# Altium schematic sheet Alaska 1-2.SchDoc
size A0; SheetNumber: 1; SheetTotal: 1
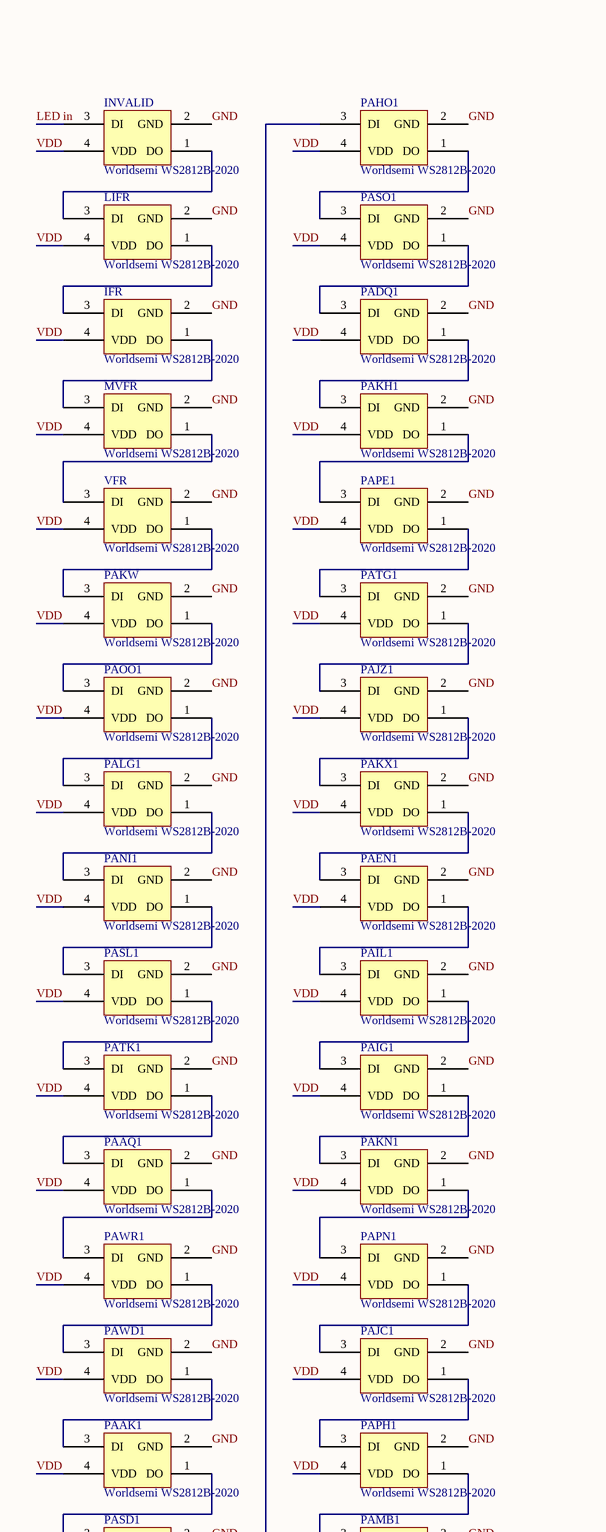
[diagram p0: Alaska 1-2.SchDoc, top left]
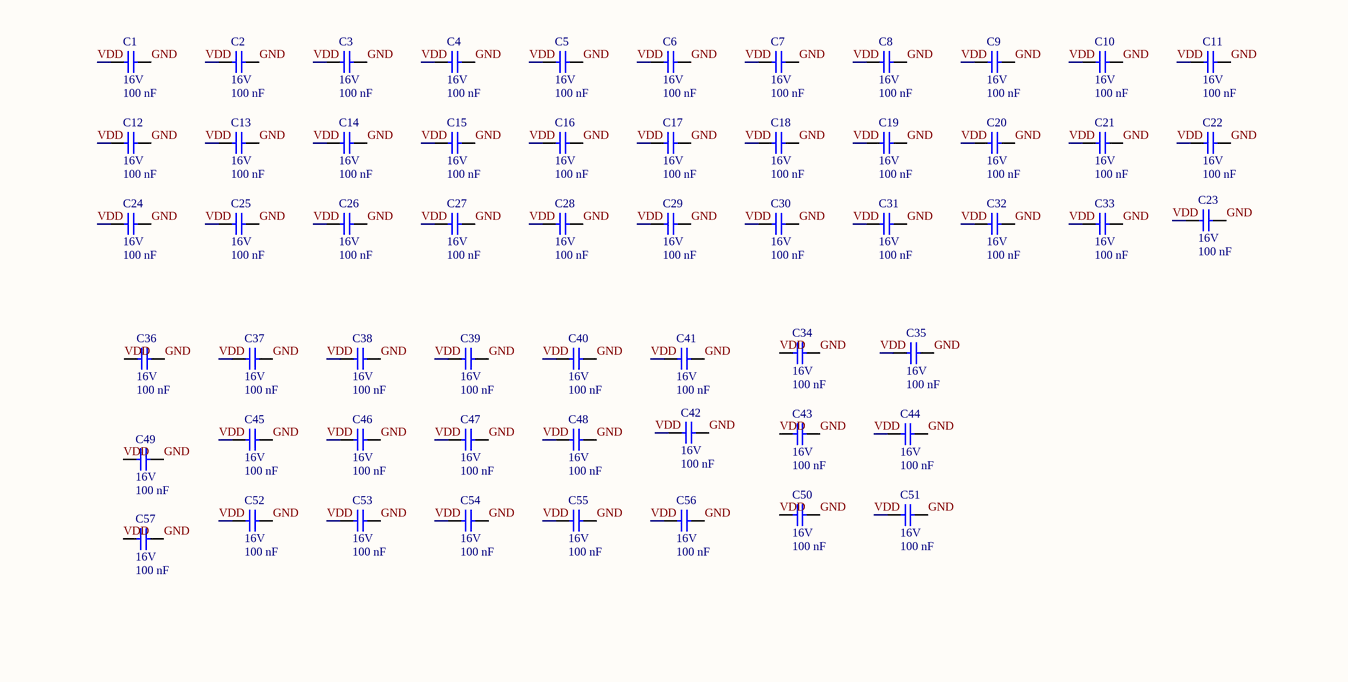
[diagram p1: Alaska 1-2.SchDoc, top middle]
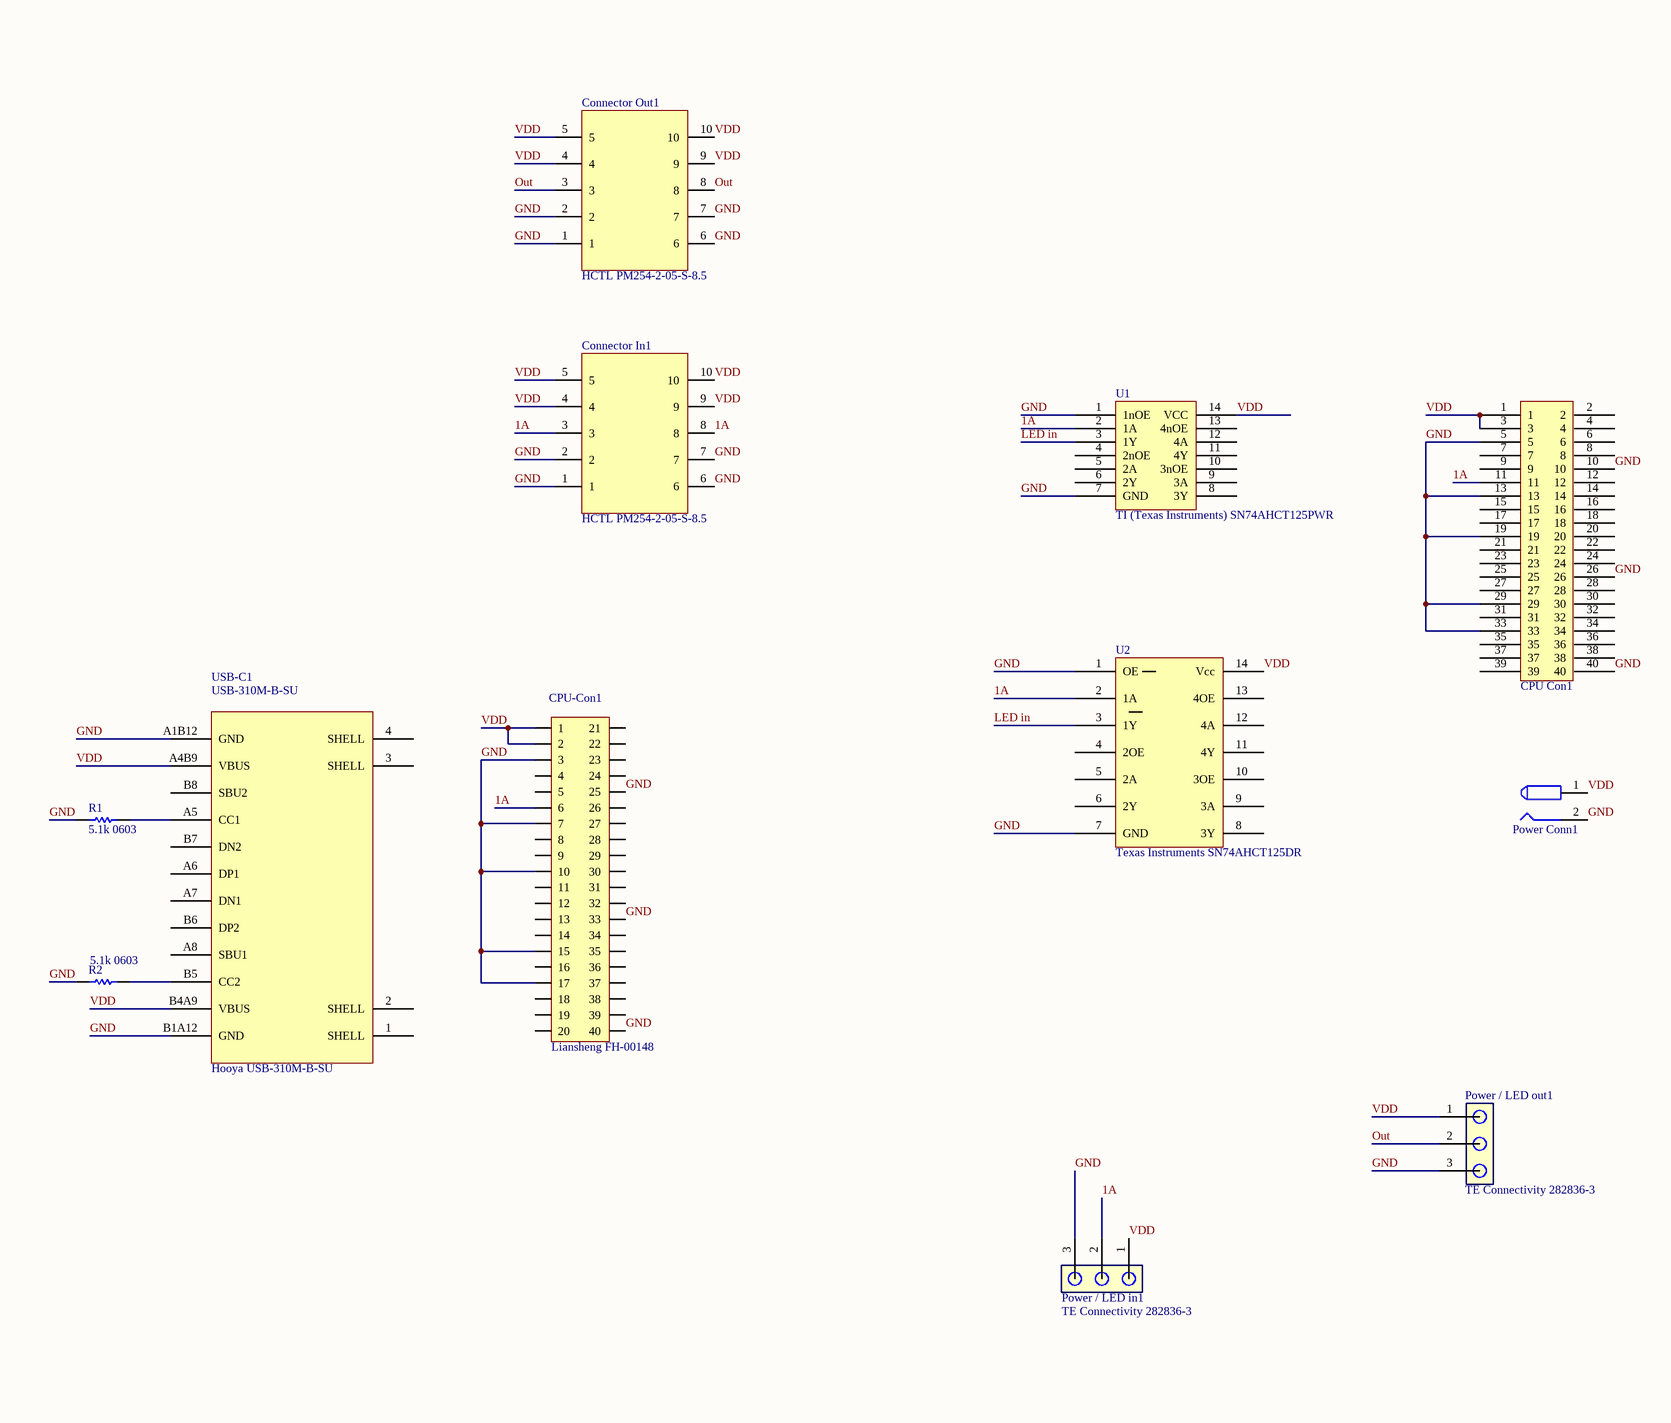
[diagram p2: Alaska 1-2.SchDoc, top right]
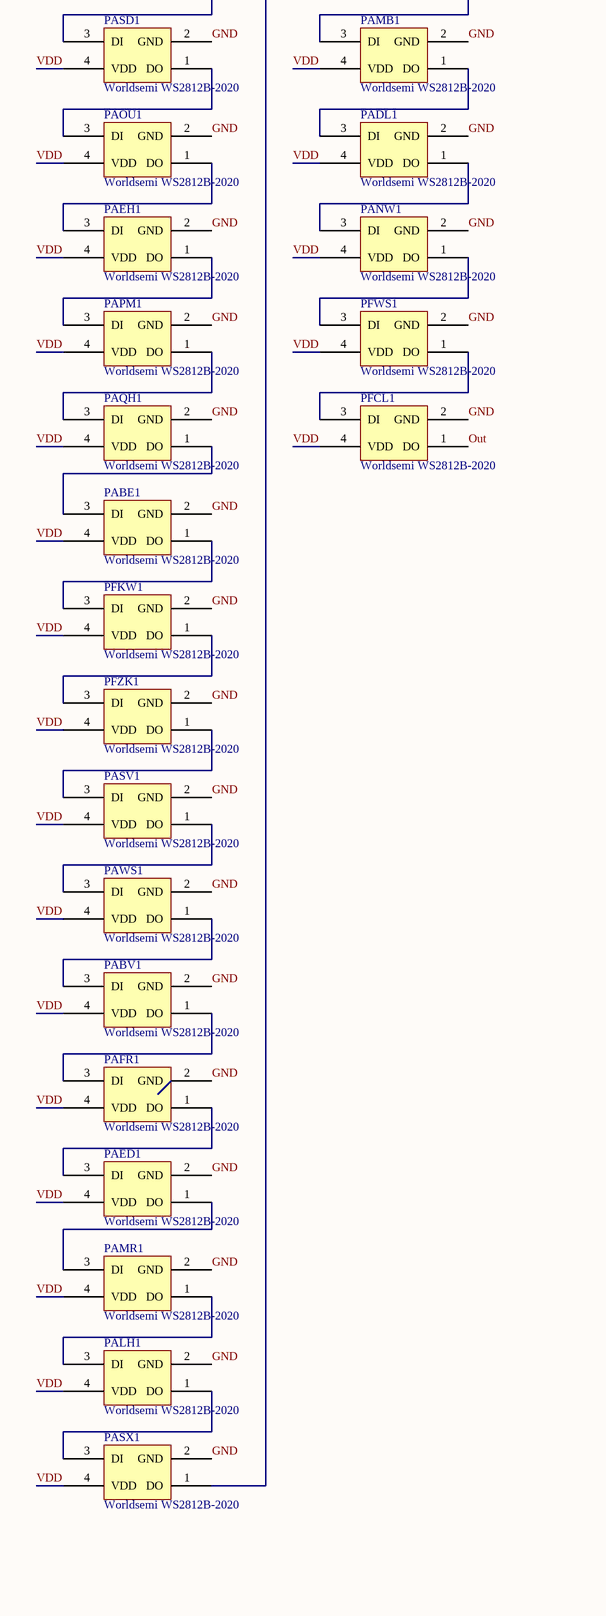
[diagram p3: Alaska 1-2.SchDoc, bottom left]
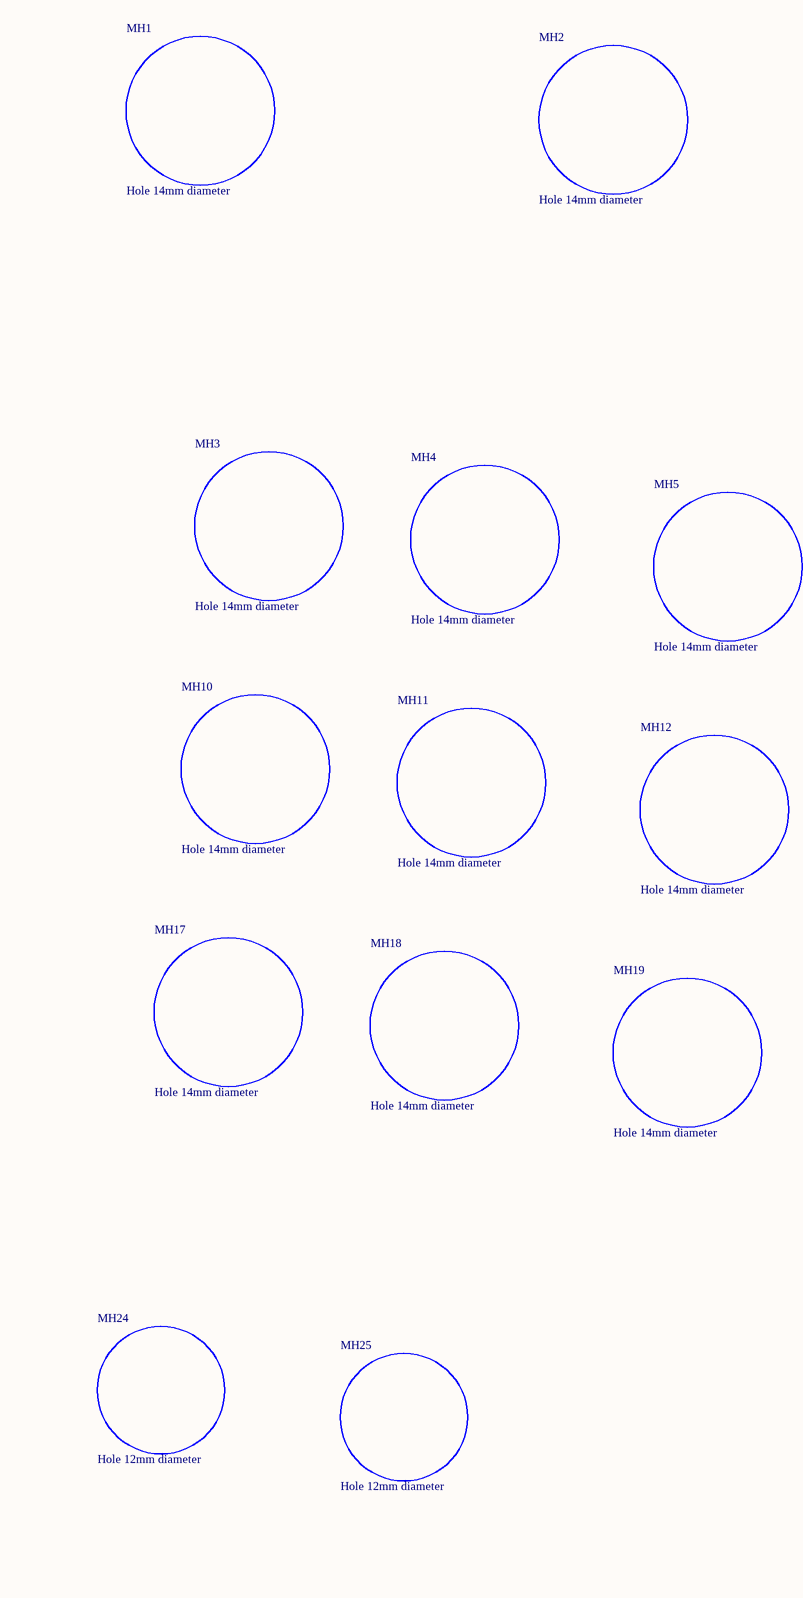
[diagram p4: Alaska 1-2.SchDoc, bottom middle]
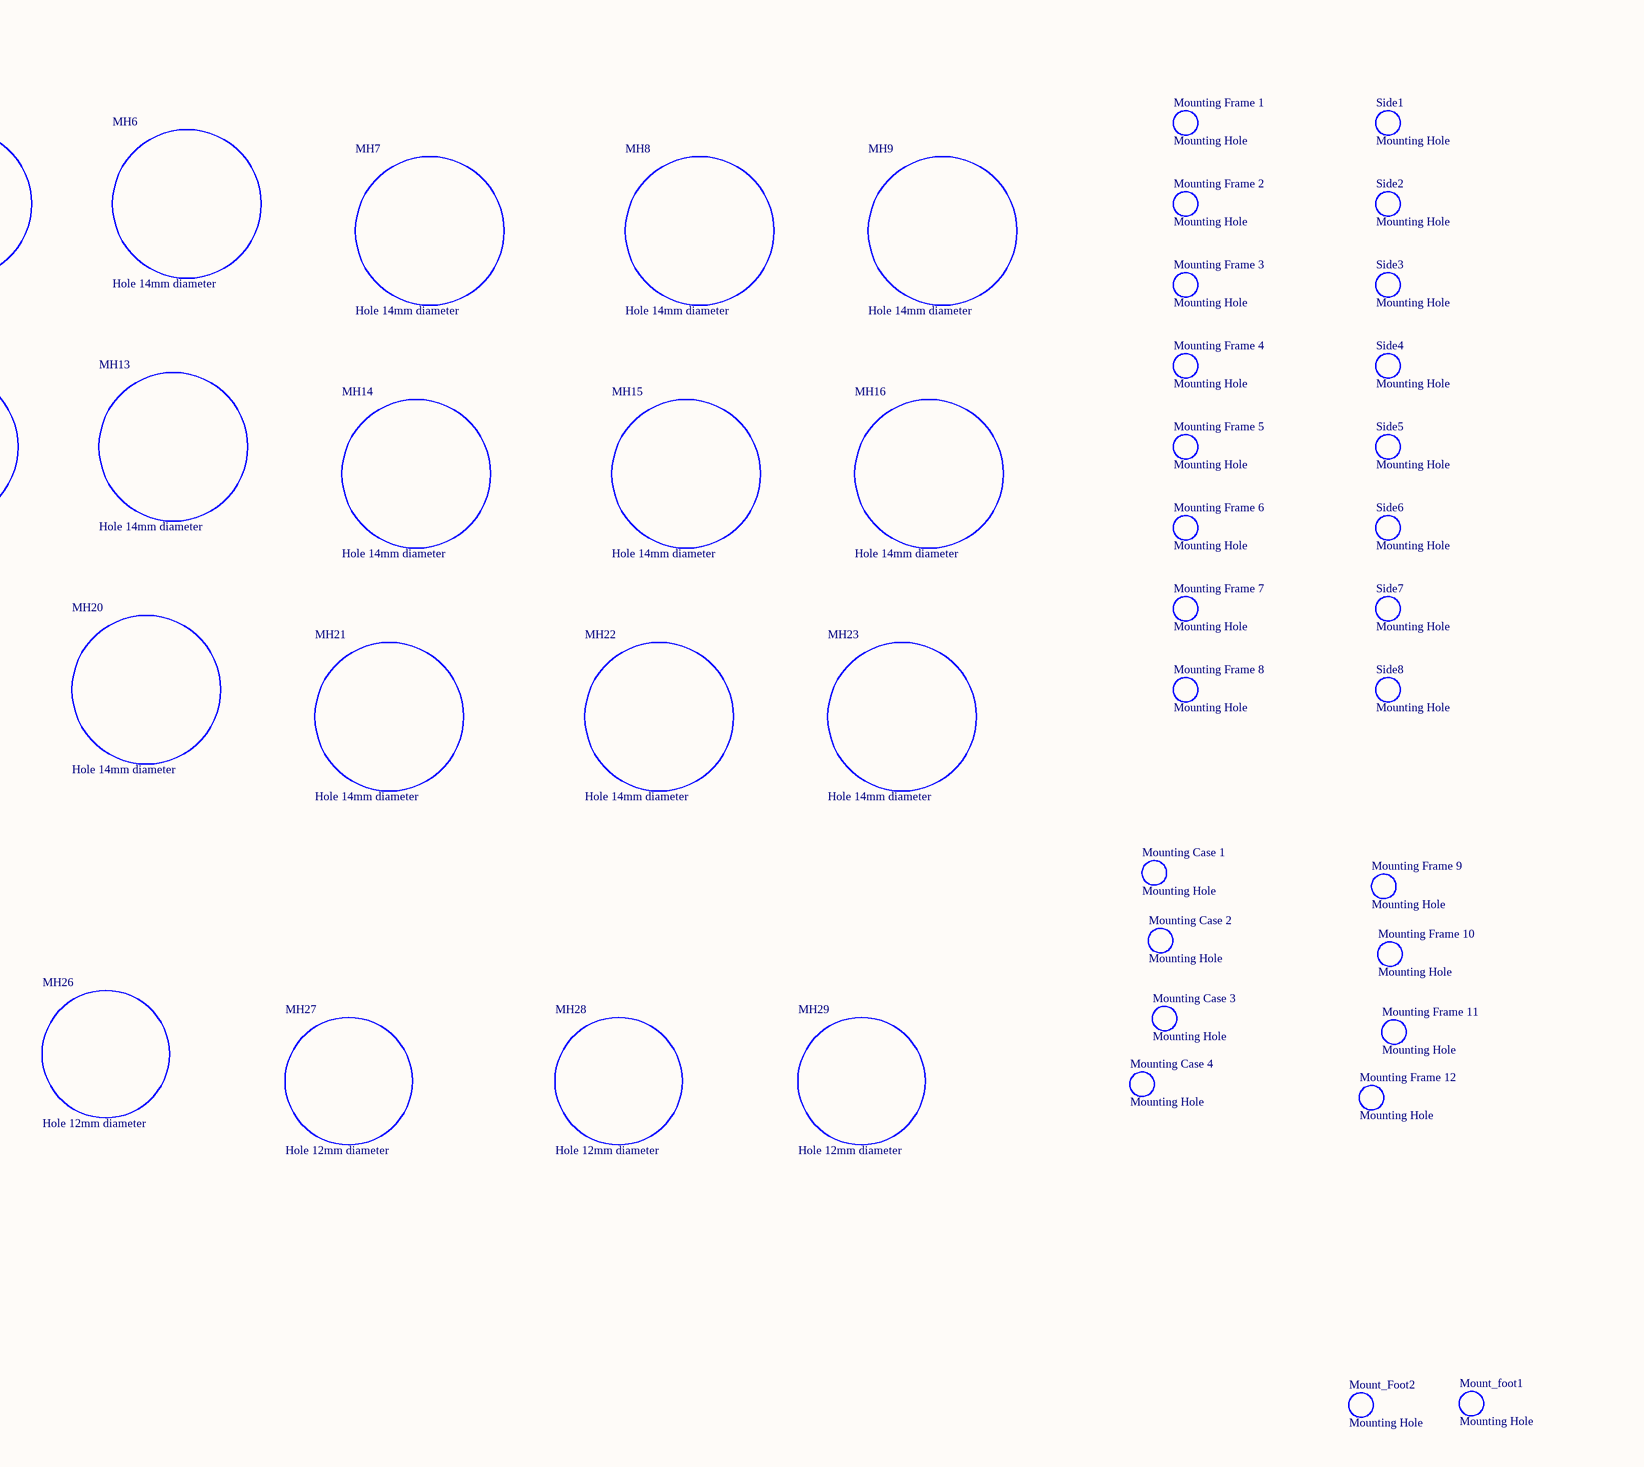
[diagram p5: Alaska 1-2.SchDoc, bottom right]

## Parts
C1  16V  Capacitance: 100 nF  [CAPC1005X56X25NL10T15]
C2  16V  Capacitance: 100 nF  [CAPC1005X56X25NL10T15]
C3  16V  Capacitance: 100 nF  [CAPC1005X56X25NL10T15]
C4  16V  Capacitance: 100 nF  [CAPC1005X56X25NL10T15]
C5  16V  Capacitance: 100 nF  [CAPC1005X56X25NL10T15]
C6  16V  Capacitance: 100 nF  [CAPC1005X56X25NL10T15]
C7  16V  Capacitance: 100 nF  [CAPC1005X56X25NL10T15]
C8  16V  Capacitance: 100 nF  [CAPC1005X56X25NL10T15]
C9  16V  Capacitance: 100 nF  [CAPC1005X56X25NL10T15]
C10  16V  Capacitance: 100 nF  [CAPC1005X56X25NL10T15]
C11  16V  Capacitance: 100 nF  [CAPC1005X56X25NL10T15]
C12  16V  Capacitance: 100 nF  [CAPC1005X56X25NL10T15]
C13  16V  Capacitance: 100 nF  [CAPC1005X56X25NL10T15]
C14  16V  Capacitance: 100 nF  [CAPC1005X56X25NL10T15]
C15  16V  Capacitance: 100 nF  [CAPC1005X56X25NL10T15]
C16  16V  Capacitance: 100 nF  [CAPC1005X56X25NL10T15]
C17  16V  Capacitance: 100 nF  [CAPC1005X56X25NL10T15]
C18  16V  Capacitance: 100 nF  [CAPC1005X56X25NL10T15]
C19  16V  Capacitance: 100 nF  [CAPC1005X56X25NL10T15]
C20  16V  Capacitance: 100 nF  [CAPC1005X56X25NL10T15]
C21  16V  Capacitance: 100 nF  [CAPC1005X56X25NL10T15]
C22  16V  Capacitance: 100 nF  [CAPC1005X56X25NL10T15]
C23  16V  Capacitance: 100 nF  [CAPC1005X56X25NL10T15]
C24  16V  Capacitance: 100 nF  [CAPC1005X56X25NL10T15]
C25  16V  Capacitance: 100 nF  [CAPC1005X56X25NL10T15]
C26  16V  Capacitance: 100 nF  [CAPC1005X56X25NL10T15]
C27  16V  Capacitance: 100 nF  [CAPC1005X56X25NL10T15]
C28  16V  Capacitance: 100 nF  [CAPC1005X56X25NL10T15]
C29  16V  Capacitance: 100 nF  [CAPC1005X56X25NL10T15]
C30  16V  Capacitance: 100 nF  [CAPC1005X56X25NL10T15]
C31  16V  Capacitance: 100 nF  [CAPC1005X56X25NL10T15]
C32  16V  Capacitance: 100 nF  [CAPC1005X56X25NL10T15]
C33  16V  Capacitance: 100 nF  [CAPC1005X56X25NL10T15]
C34  16V  Capacitance: 100 nF  [CAPC1005X56X25NL10T15]
C35  16V  Capacitance: 100 nF  [CAPC1005X56X25NL10T15]
C36  16V  Capacitance: 100 nF  [CAPC1005X56X25NL10T15]
C37  16V  Capacitance: 100 nF  [CAPC1005X56X25NL10T15]
C38  16V  Capacitance: 100 nF  [CAPC1005X56X25NL10T15]
C39  16V  Capacitance: 100 nF  [CAPC1005X56X25NL10T15]
C40  16V  Capacitance: 100 nF  [CAPC1005X56X25NL10T15]
C41  16V  Capacitance: 100 nF  [CAPC1005X56X25NL10T15]
C42  16V  Capacitance: 100 nF  [CAPC1005X56X25NL10T15]
C43  16V  Capacitance: 100 nF  [CAPC1005X56X25NL10T15]
C44  16V  Capacitance: 100 nF  [CAPC1005X56X25NL10T15]
C45  16V  Capacitance: 100 nF  [CAPC1005X56X25NL10T15]
C46  16V  Capacitance: 100 nF  [CAPC1005X56X25NL10T15]
C47  16V  Capacitance: 100 nF  [CAPC1005X56X25NL10T15]
C48  16V  Capacitance: 100 nF  [CAPC1005X56X25NL10T15]
C49  16V  Capacitance: 100 nF  [CAPC1005X56X25NL10T15]
C50  16V  Capacitance: 100 nF  [CAPC1005X56X25NL10T15]
C51  16V  Capacitance: 100 nF  [CAPC1005X56X25NL10T15]
C52  16V  Capacitance: 100 nF  [CAPC1005X56X25NL10T15]
C53  16V  Capacitance: 100 nF  [CAPC1005X56X25NL10T15]
C54  16V  Capacitance: 100 nF  [CAPC1005X56X25NL10T15]
C55  16V  Capacitance: 100 nF  [CAPC1005X56X25NL10T15]
C56  16V  Capacitance: 100 nF  [CAPC1005X56X25NL10T15]
C57  16V  Capacitance: 100 nF  [CAPC1005X56X25NL10T15]
Connector_In1  HCTL PM254-2-05-S-8.5  [PM254-2-05-S-8.5]
Connector_Out1  HCTL PM254-2-05-S-8.5  [PM254-2-05-S-8.5]
CPU-Con1  Liansheng FH-00148  [Liansheng_FH-00148_Footprint_01]
CPU_Con1  40 pin Female connector  [Harwin 40 pin Female]  (value not drawn)
IFR  Worldsemi WS2812B-2020  [PCB-18681qzhn4j348g96a9l-1]
INVALID  Worldsemi WS2812B-2020  [PCB-18681qzhn4j348g96a9l-1]
LIFR  Worldsemi WS2812B-2020  [PCB-18681qzhn4j348g96a9l-1]
MH1  Hole 14mm diameter  [Mounting Hole 14mm]
MH2  Hole 14mm diameter  [Mounting Hole 14mm]
MH3  Hole 14mm diameter  [Mounting Hole 14mm]
MH4  Hole 14mm diameter  [Mounting Hole 14mm]
MH5  Hole 14mm diameter  [Mounting Hole 14mm]
MH6  Hole 14mm diameter  [Mounting Hole 14mm]
MH7  Hole 14mm diameter  [Mounting Hole 14mm]
MH8  Hole 14mm diameter  [Mounting Hole 14mm]
MH9  Hole 14mm diameter  [Mounting Hole 14mm]
MH10  Hole 14mm diameter  [Mounting Hole 14mm]
MH11  Hole 14mm diameter  [Mounting Hole 14mm]
MH12  Hole 14mm diameter  [Mounting Hole 14mm]
MH13  Hole 14mm diameter  [Mounting Hole 14mm]
MH14  Hole 14mm diameter  [Mounting Hole 14mm]
MH15  Hole 14mm diameter  [Mounting Hole 14mm]
MH16  Hole 14mm diameter  [Mounting Hole 14mm]
MH17  Hole 14mm diameter  [Mounting Hole 14mm]
MH18  Hole 14mm diameter  [Mounting Hole 14mm]
MH19  Hole 14mm diameter  [Mounting Hole 14mm]
MH20  Hole 14mm diameter  [Mounting Hole 14mm]
MH21  Hole 14mm diameter  [Mounting Hole 14mm]
MH22  Hole 14mm diameter  [Mounting Hole 14mm]
MH23  Hole 14mm diameter  [Mounting Hole 14mm]
MH24  Hole 12mm diameter  [Mounting Hole 12mm]
MH25  Hole 12mm diameter  [Mounting Hole 12mm]
MH26  Hole 12mm diameter  [Mounting Hole 12mm]
MH27  Hole 12mm diameter  [Mounting Hole 12mm]
MH28  Hole 12mm diameter  [Mounting Hole 12mm]
MH29  Hole 12mm diameter  [Mounting Hole 12mm]
Mount_foot1  Mounting Hole  [PCB-q0vxx67e01kaxtvhakkm-1]
Mount_Foot2  Mounting Hole  [PCB-q0vxx67e01kaxtvhakkm-1]
Mounting_Case_1  Mounting Hole  [PCB-q0vxx67e01kaxtvhakkm-1]
Mounting_Case_2  Mounting Hole  [PCB-q0vxx67e01kaxtvhakkm-1]
Mounting_Case_3  Mounting Hole  [PCB-q0vxx67e01kaxtvhakkm-1]
Mounting_Case_4  Mounting Hole  [PCB-q0vxx67e01kaxtvhakkm-1]
Mounting_Frame_1  Mounting Hole  [PCB-q0vxx67e01kaxtvhakkm-1]
Mounting_Frame_2  Mounting Hole  [PCB-q0vxx67e01kaxtvhakkm-1]
Mounting_Frame_3  Mounting Hole  [PCB-q0vxx67e01kaxtvhakkm-1]
Mounting_Frame_4  Mounting Hole  [PCB-q0vxx67e01kaxtvhakkm-1]
Mounting_Frame_5  Mounting Hole  [PCB-q0vxx67e01kaxtvhakkm-1]
Mounting_Frame_6  Mounting Hole  [PCB-q0vxx67e01kaxtvhakkm-1]
Mounting_Frame_7  Mounting Hole  [PCB-q0vxx67e01kaxtvhakkm-1]
Mounting_Frame_8  Mounting Hole  [PCB-q0vxx67e01kaxtvhakkm-1]
Mounting_Frame_9  Mounting Hole  [PCB-q0vxx67e01kaxtvhakkm-1]
Mounting_Frame_10  Mounting Hole  [PCB-q0vxx67e01kaxtvhakkm-1]
Mounting_Frame_11  Mounting Hole  [PCB-q0vxx67e01kaxtvhakkm-1]
Mounting_Frame_12  Mounting Hole  [PCB-q0vxx67e01kaxtvhakkm-1]
MVFR  Worldsemi WS2812B-2020  [PCB-18681qzhn4j348g96a9l-1]
PAAK1  Worldsemi WS2812B-2020  [PCB-18681qzhn4j348g96a9l-1]
PAAQ1  Worldsemi WS2812B-2020  [PCB-18681qzhn4j348g96a9l-1]
PABE1  Worldsemi WS2812B-2020  [PCB-18681qzhn4j348g96a9l-1]
PABV1  Worldsemi WS2812B-2020  [PCB-18681qzhn4j348g96a9l-1]
PADL1  Worldsemi WS2812B-2020  [PCB-18681qzhn4j348g96a9l-1]
PADQ1  Worldsemi WS2812B-2020  [PCB-18681qzhn4j348g96a9l-1]
PAED1  Worldsemi WS2812B-2020  [PCB-18681qzhn4j348g96a9l-1]
PAEH1  Worldsemi WS2812B-2020  [PCB-18681qzhn4j348g96a9l-1]
PAEN1  Worldsemi WS2812B-2020  [PCB-18681qzhn4j348g96a9l-1]
PAFR1  Worldsemi WS2812B-2020  [PCB-18681qzhn4j348g96a9l-1]
PAHO1  Worldsemi WS2812B-2020  [PCB-18681qzhn4j348g96a9l-1]
PAIG1  Worldsemi WS2812B-2020  [PCB-18681qzhn4j348g96a9l-1]
PAIL1  Worldsemi WS2812B-2020  [PCB-18681qzhn4j348g96a9l-1]
PAJC1  Worldsemi WS2812B-2020  [PCB-18681qzhn4j348g96a9l-1]
PAJZ1  Worldsemi WS2812B-2020  [PCB-18681qzhn4j348g96a9l-1]
PAKH1  Worldsemi WS2812B-2020  [PCB-18681qzhn4j348g96a9l-1]
PAKN1  Worldsemi WS2812B-2020  [PCB-18681qzhn4j348g96a9l-1]
PAKW  Worldsemi WS2812B-2020  [PCB-18681qzhn4j348g96a9l-1]
PAKX1  Worldsemi WS2812B-2020  [PCB-18681qzhn4j348g96a9l-1]
PALG1  Worldsemi WS2812B-2020  [PCB-18681qzhn4j348g96a9l-1]
PALH1  Worldsemi WS2812B-2020  [PCB-18681qzhn4j348g96a9l-1]
PAMB1  Worldsemi WS2812B-2020  [PCB-18681qzhn4j348g96a9l-1]
PAMR1  Worldsemi WS2812B-2020  [PCB-18681qzhn4j348g96a9l-1]
PANI1  Worldsemi WS2812B-2020  [PCB-18681qzhn4j348g96a9l-1]
PANW1  Worldsemi WS2812B-2020  [PCB-18681qzhn4j348g96a9l-1]
PAOO1  Worldsemi WS2812B-2020  [PCB-18681qzhn4j348g96a9l-1]
PAOU1  Worldsemi WS2812B-2020  [PCB-18681qzhn4j348g96a9l-1]
PAPE1  Worldsemi WS2812B-2020  [PCB-18681qzhn4j348g96a9l-1]
PAPH1  Worldsemi WS2812B-2020  [PCB-18681qzhn4j348g96a9l-1]
PAPM1  Worldsemi WS2812B-2020  [PCB-18681qzhn4j348g96a9l-1]
PAPN1  Worldsemi WS2812B-2020  [PCB-18681qzhn4j348g96a9l-1]
PAQH1  Worldsemi WS2812B-2020  [PCB-18681qzhn4j348g96a9l-1]
PASD1  Worldsemi WS2812B-2020  [PCB-18681qzhn4j348g96a9l-1]
PASL1  Worldsemi WS2812B-2020  [PCB-18681qzhn4j348g96a9l-1]
PASO1  Worldsemi WS2812B-2020  [PCB-18681qzhn4j348g96a9l-1]
PASV1  Worldsemi WS2812B-2020  [PCB-18681qzhn4j348g96a9l-1]
PASX1  Worldsemi WS2812B-2020  [PCB-18681qzhn4j348g96a9l-1]
PATG1  Worldsemi WS2812B-2020  [PCB-18681qzhn4j348g96a9l-1]
PATK1  Worldsemi WS2812B-2020  [PCB-18681qzhn4j348g96a9l-1]
PAWD1  Worldsemi WS2812B-2020  [PCB-18681qzhn4j348g96a9l-1]
PAWR1  Worldsemi WS2812B-2020  [PCB-18681qzhn4j348g96a9l-1]
PAWS1  Worldsemi WS2812B-2020  [PCB-18681qzhn4j348g96a9l-1]
PFCL1  Worldsemi WS2812B-2020  [PCB-18681qzhn4j348g96a9l-1]
PFKW1  Worldsemi WS2812B-2020  [PCB-18681qzhn4j348g96a9l-1]
PFWS1  Worldsemi WS2812B-2020  [PCB-18681qzhn4j348g96a9l-1]
PFZK1  Worldsemi WS2812B-2020  [PCB-18681qzhn4j348g96a9l-1]
Power_/_LED_in1  TE Connectivity 282836-3  [282836-3]
Power_/_LED_out1  TE Connectivity 282836-3  [282836-3]
Power_Conn1  CMP-330397-12  [PCB-h5dulpljww4oyv25n50t-1]  (value not drawn)
R1  5.1k 0603  [CAPC1608X90X35NL15T15]
R2  5.1k 0603  [CAPC1608X90X35NL15T15]
Side1  Mounting Hole  [PCB-q0vxx67e01kaxtvhakkm-1]
Side2  Mounting Hole  [PCB-q0vxx67e01kaxtvhakkm-1]
Side3  Mounting Hole  [PCB-q0vxx67e01kaxtvhakkm-1]
Side4  Mounting Hole  [PCB-q0vxx67e01kaxtvhakkm-1]
Side5  Mounting Hole  [PCB-q0vxx67e01kaxtvhakkm-1]
Side6  Mounting Hole  [PCB-q0vxx67e01kaxtvhakkm-1]
Side7  Mounting Hole  [PCB-q0vxx67e01kaxtvhakkm-1]
Side8  Mounting Hole  [PCB-q0vxx67e01kaxtvhakkm-1]
U1  TI (Texas Instruments) SN74AHCT125PWR  [PCB-19361381-1]
U2  Texas Instruments SN74AHCT125DR  [PCB-4n9l8bvb0hxmq9svv09s-1]
USB-C1  Hooya USB-310M-B-SU  [Hooya USB-310M-B-SU-Footprint-1]
VFR  Worldsemi WS2812B-2020  [PCB-18681qzhn4j348g96a9l-1]

## Nets
1A: Connector_In1.3 Connector_In1.8 CPU-Con1.6 CPU_Con1.11 Power_/_LED_in1.2 U1.2(1A) U2.2(1A)
GND: C1.2 C2.2 C3.2 C4.2 C5.2 C6.2 C7.2 C8.2 C9.2 C10.2 C11.2 C12.2 C13.2 C14.2 C15.2 C16.2 C17.2 C18.2 C19.2 C20.2 C21.2 C22.2 C23.2 C24.2 C25.2 C26.2 C27.2 C28.2 C29.2 C30.2 C31.2 C32.2 C33.2 C34.2 C35.2 C36.2 C37.2 C38.2 C39.2 C40.2 C41.2 C42.2 C43.2 C44.2 C45.2 C46.2 C47.2 C48.2 C49.2 C50.2 C51.2 C52.2 C53.2 C54.2 C55.2 C56.2 C57.2 Connector_In1.1 Connector_In1.2 Connector_In1.6 Connector_In1.7 Connector_Out1.1 Connector_Out1.2 Connector_Out1.6 Connector_Out1.7 CPU-Con1.3 CPU-Con1.7 CPU-Con1.10 CPU-Con1.15 CPU-Con1.17 CPU-Con1.25 CPU-Con1.33 CPU-Con1.40 CPU_Con1.5 CPU_Con1.10 CPU_Con1.13 CPU_Con1.19 CPU_Con1.26 CPU_Con1.29 CPU_Con1.33 CPU_Con1.40 IFR.2(GND) INVALID.2(GND) LIFR.2(GND) MVFR.2(GND) PAAK1.2(GND) PAAQ1.2(GND) PABE1.2(GND) PABV1.2(GND) PADL1.2(GND) PADQ1.2(GND) PAED1.2(GND) PAEH1.2(GND) PAEN1.2(GND) PAFR1.2(GND) PAHO1.2(GND) PAIG1.2(GND) PAIL1.2(GND) PAJC1.2(GND) PAJZ1.2(GND) PAKH1.2(GND) PAKN1.2(GND) PAKW.2(GND) PAKX1.2(GND) PALG1.2(GND) PALH1.2(GND) PAMB1.2(GND) PAMR1.2(GND) PANI1.2(GND) PANW1.2(GND) PAOO1.2(GND) PAOU1.2(GND) PAPE1.2(GND) PAPH1.2(GND) PAPM1.2(GND) PAPN1.2(GND) PAQH1.2(GND) PASD1.2(GND) PASL1.2(GND) PASO1.2(GND) PASV1.2(GND) PASX1.2(GND) PATG1.2(GND) PATK1.2(GND) PAWD1.2(GND) PAWR1.2(GND) PAWS1.2(GND) PFCL1.2(GND) PFKW1.2(GND) PFWS1.2(GND) PFZK1.2(GND) Power_/_LED_in1.3 Power_/_LED_out1.3 Power_Conn1.2(NEG) R1.1 R2.1 U1.1(1nOE) U1.7(GND) U2.1(OE) U2.7(GND) USB-C1.A1B12(GND) USB-C1.B1A12(GND) VFR.2(GND)
LED in: INVALID.3(DI) U1.3(1Y) U2.3(1Y)
Out: Connector_Out1.3 Connector_Out1.8 PFCL1.1(DO) Power_/_LED_out1.2
VDD: C1.1 C2.1 C3.1 C4.1 C5.1 C6.1 C7.1 C8.1 C9.1 C10.1 C11.1 C12.1 C13.1 C14.1 C15.1 C16.1 C17.1 C18.1 C19.1 C20.1 C21.1 C22.1 C23.1 C24.1 C25.1 C26.1 C27.1 C28.1 C29.1 C30.1 C31.1 C32.1 C33.1 C34.1 C35.1 C36.1 C37.1 C38.1 C39.1 C40.1 C41.1 C42.1 C43.1 C44.1 C45.1 C46.1 C47.1 C48.1 C49.1 C50.1 C51.1 C52.1 C53.1 C54.1 C55.1 C56.1 C57.1 Connector_In1.4 Connector_In1.5 Connector_In1.9 Connector_In1.10 Connector_Out1.4 Connector_Out1.5 Connector_Out1.9 Connector_Out1.10 CPU-Con1.1 CPU-Con1.2 CPU_Con1.1 CPU_Con1.3 IFR.4(VDD) INVALID.4(VDD) LIFR.4(VDD) MVFR.4(VDD) PAAK1.4(VDD) PAAQ1.4(VDD) PABE1.4(VDD) PABV1.4(VDD) PADL1.4(VDD) PADQ1.4(VDD) PAED1.4(VDD) PAEH1.4(VDD) PAEN1.4(VDD) PAFR1.4(VDD) PAHO1.4(VDD) PAIG1.4(VDD) PAIL1.4(VDD) PAJC1.4(VDD) PAJZ1.4(VDD) PAKH1.4(VDD) PAKN1.4(VDD) PAKW.4(VDD) PAKX1.4(VDD) PALG1.4(VDD) PALH1.4(VDD) PAMB1.4(VDD) PAMR1.4(VDD) PANI1.4(VDD) PANW1.4(VDD) PAOO1.4(VDD) PAOU1.4(VDD) PAPE1.4(VDD) PAPH1.4(VDD) PAPM1.4(VDD) PAPN1.4(VDD) PAQH1.4(VDD) PASD1.4(VDD) PASL1.4(VDD) PASO1.4(VDD) PASV1.4(VDD) PASX1.4(VDD) PATG1.4(VDD) PATK1.4(VDD) PAWD1.4(VDD) PAWR1.4(VDD) PAWS1.4(VDD) PFCL1.4(VDD) PFKW1.4(VDD) PFWS1.4(VDD) PFZK1.4(VDD) Power_/_LED_in1.1 Power_/_LED_out1.1 Power_Conn1.1(POS) U1.14(VCC) U2.14(Vcc) USB-C1.A4B9(VBUS) USB-C1.B4A9(VBUS) VFR.4(VDD)
NetIFR_1: IFR.1(DO) MVFR.3(DI)
NetIFR_3: IFR.3(DI) LIFR.1(DO)
NetINVALID_1: INVALID.1(DO) LIFR.3(DI)
NetMVFR_1: MVFR.1(DO) VFR.3(DI)
NetPAAK1_1: PAAK1.1(DO) PASD1.3(DI)
NetPAAK1_3: PAAK1.3(DI) PAWD1.1(DO)
NetPAAQ1_1: PAAQ1.1(DO) PAWR1.3(DI)
NetPAAQ1_3: PAAQ1.3(DI) PATK1.1(DO)
NetPABE1_1: PABE1.1(DO) PFKW1.3(DI)
NetPABE1_3: PABE1.3(DI) PAQH1.1(DO)
NetPABV1_1: PABV1.1(DO) PAFR1.3(DI)
NetPABV1_3: PABV1.3(DI) PAWS1.1(DO)
NetPADL1_1: PADL1.1(DO) PANW1.3(DI)
NetPADL1_3: PADL1.3(DI) PAMB1.1(DO)
NetPADQ1_1: PADQ1.1(DO) PAKH1.3(DI)
NetPADQ1_3: PADQ1.3(DI) PASO1.1(DO)
NetPAED1_1: PAED1.1(DO) PAMR1.3(DI)
NetPAED1_3: PAED1.3(DI) PAFR1.1(DO)
NetPAEH1_1: PAEH1.1(DO) PAPM1.3(DI)
NetPAEH1_3: PAEH1.3(DI) PAOU1.1(DO)
NetPAEN1_1: PAEN1.1(DO) PAIL1.3(DI)
NetPAEN1_3: PAEN1.3(DI) PAKX1.1(DO)
NetPAHO1_1: PAHO1.1(DO) PASO1.3(DI)
NetPAHO1_3: PAHO1.3(DI) PASX1.1(DO)
NetPAIG1_1: PAIG1.1(DO) PAKN1.3(DI)
NetPAIG1_3: PAIG1.3(DI) PAIL1.1(DO)
NetPAJC1_1: PAJC1.1(DO) PAPH1.3(DI)
NetPAJC1_3: PAJC1.3(DI) PAPN1.1(DO)
NetPAJZ1_1: PAJZ1.1(DO) PAKX1.3(DI)
NetPAJZ1_3: PAJZ1.3(DI) PATG1.1(DO)
NetPAKH1_1: PAKH1.1(DO) PAPE1.3(DI)
NetPAKN1_1: PAKN1.1(DO) PAPN1.3(DI)
NetPAKW_1: PAKW.1(DO) PAOO1.3(DI)
NetPAKW_3: PAKW.3(DI) VFR.1(DO)
NetPALG1_1: PALG1.1(DO) PANI1.3(DI)
NetPALG1_3: PALG1.3(DI) PAOO1.1(DO)
NetPALH1_1: PALH1.1(DO) PASX1.3(DI)
NetPALH1_3: PALH1.3(DI) PAMR1.1(DO)
NetPAMB1_3: PAMB1.3(DI) PAPH1.1(DO)
NetPANI1_1: PANI1.1(DO) PASL1.3(DI)
NetPANW1_1: PANW1.1(DO) PFWS1.3(DI)
NetPAOU1_3: PAOU1.3(DI) PASD1.1(DO)
NetPAPE1_1: PAPE1.1(DO) PATG1.3(DI)
NetPAPM1_1: PAPM1.1(DO) PAQH1.3(DI)
NetPASL1_1: PASL1.1(DO) PATK1.3(DI)
NetPASV1_1: PASV1.1(DO) PAWS1.3(DI)
NetPASV1_3: PASV1.3(DI) PFZK1.1(DO)
NetPAWD1_3: PAWD1.3(DI) PAWR1.1(DO)
NetPFCL1_3: PFCL1.3(DI) PFWS1.1(DO)
NetPFKW1_1: PFKW1.1(DO) PFZK1.3(DI)
NetR1_2: R1.2 USB-C1.A5(CC1)
NetR2_2: R2.2 USB-C1.B5(CC2)

Not connected (* = marked no-connect by the designer): CPU-Con1 4 5 8 9 11 12 13 14 16 18 19 20 21 22 23 24 26 27 28 29 30 31 32 34 35 36 37 38 39; CPU_Con1 2 4 6 7 8 9 12 14 15 16 17 18 20 21 22 23 24 25 27 28 30 31 32 34 35 36 37 38 39; U1 4(2nOE) 5(2A) 6(2Y) 8(3Y) 9(3A) 10(3nOE) 11(4Y) 12(4A) 13(4nOE); U2 4(2OE) 5(2A) 6(2Y) 8(3Y) 9(3A) 10(3OE) 11(4Y) 12(4A) 13(4OE); USB-C1 1(SHELL) 2(SHELL) 3(SHELL) 4(SHELL) A6(DP1) A7(DN1) A8(SBU1) B6(DP2) B7(DN2) B8(SBU2)

## Library data of the parts
C1-C57 = CMP-bf2276a55d9a60e5-20: Generic CAP 0402, =Capacitance+','+Tolerance+','+Voltage+','+Dielectric+','+Case; Manufacturer Part Number: TBD; Lead-Free Status: Lead Free; Voltage: 25V; Dielectric: CGO; Tolerance: ±10%; Octopart URL: TBD; Case: 0402; OctopartID: 0755ced2c795d892; RoHS: Compliant; Mounting Style: Surface Mount; Footprint: PCB-0002-00476-3
Connector_In1 Connector_Out1 = PM254-2-05-S-8.5: 2.54mm 2.54mm 260℃@5S 3A -40℃~+105℃ Copper Alloy 10P Brick nogging 2x5P Top 8.5mm Square Hole SMD,P=2.54mm Female Headers ROHS; ComponentLink1Description: New link; ComponentLink1URL: https://www.lcsc.com/product-detail/Female-Headers_HCTL-PM254-2-05-S-8-5_C3975150.html
CPU-Con1 = CMP-xf5hfsu41fuj64nwsg7i-2: 2.54mm 2.54mm 3A Gold Brass -40℃~+105℃ 260℃@10S Brick nogging 2x20P 7.1mm Top 40 Square Holes SMD,P=2.54mm Female Headers ROHS; ComponentLink1Description: Website; ComponentLink1URL: https://www.lcsc.com/product-detail/Female-Headers_Liansheng-FH-00148_C2685092.html; CustomComponentID: xf5hfsu41fuj64nwsg7i
CPU_Con1 = CMP-2482621-16: 2.54mm (0.1") Pitch DIL Vertical PC Tail Socket Assembly, tin, 20+20 contacts
IFR INVALID LIFR MVFR PAAK1 PAAQ1 PABE1 PABV1 PADL1 PADQ1 PAED1 PAEH1 PAEN1 PAFR1 PAHO1 PAIG1 PAIL1 PAJC1 PAJZ1 PAKH1 PAKN1 PAKW PAKX1 PALG1 PALH1 PAMB1 PAMR1 PANI1 PANW1 PAOO1 PAOU1 PAPE1 PAPH1 PAPM1 PAPN1 PAQH1 PASD1 PASL1 PASO1 PASV1 PASX1 PATG1 PATK1 PAWD1 PAWR1 PAWS1 PFCL1 PFKW1 PFWS1 PFZK1 VFR = CMP-30b1feb25fa9ef76-6: Manufacturer Part Number: WS2812B-2020; Octopart URL: https://octopart.com/ws2812b-2020-worldsemi-118049406; OctopartID: 30b1feb25fa9ef76
MH1-MH23 = Mounting Hole 14mm: Hole for mounting
MH24-MH29 = Mounting Hole 12mm: Hole for mounting
Mount_foot1 Mount_Foot2 Mounting_Case_1-Mounting_Case_4 Mounting_Frame_1-Mounting_Frame_12 Side1-Side8 = CMP-q3gk3wg8yin1w7wp8pag-1: Mounting Hole 3.5mm; CustomComponentID: q3gk3wg8yin1w7wp8pag
Power_/_LED_in1 Power_/_LED_out1 = CMP-d7c21c93a45c0805-15: Conn; Term Blk; Wire Receptacle; 3; 5 mm; 30-16 AWG; Green; 13.5 A; 300 V; Number of Contacts: 3; Lead-Free Status: Lead Free; Pin Pitch: 5.00 mm; Wire Gauge: 15.0 AWG; Voltage Rating (AC): 250 V; Current Rating: 13.5 A; ELV Compliant: Compliant; Octopart URL: http://octopart.com/282836-3-te+connectivity-39540472; Manufacturer Part Number: 282836-3; Housing Material: Nylon 6/6; Housing Color: Green; RoHS: Compliant; Orientation: Right Angle; Mounting Style: PCB; Number of Positions: 3; Insulation Material: Nylon; Flammability Rating: UL 94 V-0; OctopartID: d7c21c93a45c0805; Lifecycle Status: Active; REACH SVHC Compliance: No SVHC; Color: Green; Contact Plating: Tin; Contact Material: Brass
Power_Conn1 = CMP-330397-12: CUI PJ-037A; Shielding: No
R1 R2 = CMP-3656428-4: Res Thick Film 0603 5.1K Ohm 1% 1/10W ±100ppm/°C Molded SMD SMD Punched Carrier T/R; Manufacturer Part Number: ERJ-3EKF5101V; Voltage Rating (DC): 75.0 V; Power Rating: 100 mW; Lead-Free Status: Lead Free; Resistance: 5.1 kΩ; REACH SVHC Compliance: No SVHC; Lifecycle Status: Not Listed by Manufacturer; Packaging: Cut Tape (CT); Mounting Style: Surface Mount; RoHS: Compliant; OctopartID: 45aa8fedcba59a6d; Case/Package: 0603; Octopart URL: http://octopart.com/erj-3ekf5101v-panasonic-55421801; Resistance Tolerance: ±1%
U1 = CMP-13613041-2: IC BUS BUFFER TRI-ST QD 14TSSOP; Lead-Free Status: Lead Free; Number of Bits: 4; Output Current Drive: -0.001 A; Propagation Delay Max (tpd): 8.5e-09 s; Voltage Nodes: 5.0 V; Case/Package: TSSOP; Lifecycle Status: Active; Mounting Style: Surface Mount; Number of Circuits: 4; Number of Outputs: 4; Number of Pins: 14; Octopart Url: https://octopart.com/sn74ahct125pwr-texas+instruments-46548606; OctopartID: 822b49e7e1335dec; Packaging: Cut Tape (CT); REACH SVHC Compliance: No SVHC; RoHS: Compliant; Manufacturer Part Number: SN74AHCT125PWR
U2 = CMP-35ebfce60942ea2c-2: Buffer/Line Driver 4-CH Non-Inverting 3-ST CMOS 14-Pin SOIC T/R; Number of Outputs: 4; Voltage Nodes: 5.00 V; Propagation Delay Max (tpd): 8.50 ns; Quiescent Current: 2.00 µA (max); Supply Voltage (DC): 4.50 V to 5.50 V; Output Current Drive: -1.00 mA; Lead-Free Status: Lead Free; Packaging: Tape & Reel (TR); Lifecycle Status: Active; Operating Temperature: -40.0 °C (min); Manufacturer Part Number: SN74AHCT125DR; Case/Package: SOIC-14_3.9x8.7x1.27P; Mounting Style: Surface Mount; OctopartID: 35ebfce60942ea2c; Octopart URL: https://octopart.com/sn74ahct125dr-texas+instruments-465359; RoHS: Compliant; Number of Pins: 14; REACH SVHC Compliance: No SVHC; Number of Circuits: 4; Number of Bits: 4
USB-C1 = CMP-967358be92de49b4-1: 3A 1 Surface Mount 16 Female Type-C SMD USB Connector ROHS; Manufacturer Part Number: USB-310M-B-SU; OctopartID: 967358be92de49b4; Octopart Url: https://octopart.com/usb-310m-b-su-hooya-130490827